# Altium schematic sheet Sheet1.SchDoc
size A4; SheetNumber: 1; SheetTotal: 1
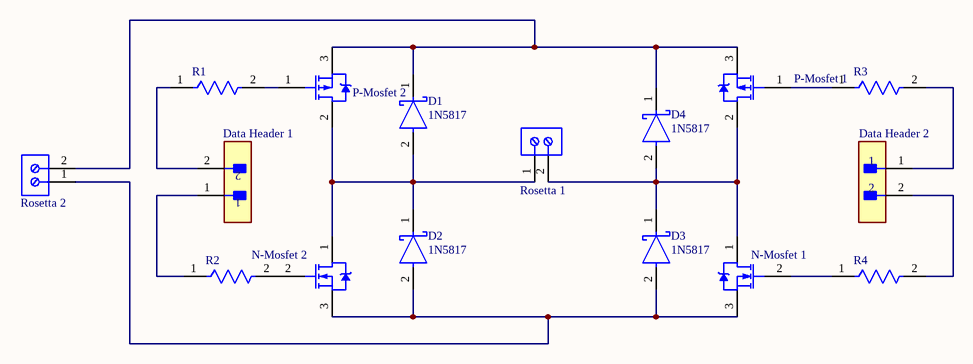
[diagram p0: Sheet1.SchDoc]

## Parts
D1  1N5817  [FP-DO-41-MFG]
D2  1N5817  [FP-DO-41-MFG]
D3  1N5817  [FP-DO-41-MFG]
D4  1N5817  [FP-DO-41-MFG]
Data_Header_1  M20-9990245  [FP-M20-9990245-MFG]  (value not drawn)
Data_Header_2  M20-9990245  [FP-M20-9990245-MFG]  (value not drawn)
N-Mosfet_1  BS170  [ONSC-TO-92-3-29-11]  (value not drawn)
N-Mosfet_2  BS170  [ONSC-TO-92-3-29-11]  (value not drawn)
P-Mosfet_1  NTP2955  [ONSC-TO-220-3-221A-09_AA]  (value not drawn)
P-Mosfet_2  NTP2955  [ONSC-TO-220-3-221A-09_AA]  (value not drawn)
R1  H45K0BAA  [FP-H45K0BAA-MFG]  (value not drawn)
R2  H45K0BAA  [FP-H45K0BAA-MFG]  (value not drawn)
R3  H45K0BAA  [FP-H45K0BAA-MFG]  (value not drawn)
R4  H45K0BAA  [FP-H45K0BAA-MFG]  (value not drawn)
Rosetta_1  691214110002  [691214110002]  (value not drawn)
Rosetta_2  691214110002  [691214110002]  (value not drawn)

## Nets
NetD1_1: D1.1(C) D4.1(C) P-Mosfet_1.3(S) P-Mosfet_2.3(S) Rosetta_2.2
NetD1_2: D1.2(A) D2.1(C) N-Mosfet_2.1(D) P-Mosfet_2.2(D) Rosetta_1.1
NetD2_2: D2.2(A) D3.2(A) N-Mosfet_1.3(S) N-Mosfet_2.3(S) Rosetta_2.1
NetD3_1: D3.1(C) D4.2(A) N-Mosfet_1.1(D) P-Mosfet_1.2(D) Rosetta_1.2
NetData_Header_1_1: Data_Header_1.1 R2.1
NetData_Header_1_2: Data_Header_1.2 R1.1
NetData_Header_2_1: Data_Header_2.1 R3.2
NetData_Header_2_2: Data_Header_2.2 R4.2
NetN-Mosfet_1_2: N-Mosfet_1.2(G) R4.1
NetN-Mosfet_2_2: N-Mosfet_2.2(G) R2.2
NetP-Mosfet_1_1: P-Mosfet_1.1(G) R3.1
NetP-Mosfet_2_1: P-Mosfet_2.1(G) R1.2

## Library data of the parts
D1-D4 = CMP-12187-000037-1: DIODE SCHOTTKY 20V 1A DO41; Max Forward Surge Current (Ifsm): 25A; Forward Voltage: 450mV; Max Reverse Leakage Current: 500uA; Element Configuration: Single; Polarity: Standard; Capacitance: 110pF; Length: 5.2mm; Min Operating Temperature: -65°C; Series: -; Packaging: Cut Tape; Output Current: 1A; RoHS Compliant: Yes; Max Surge Current: 25A; Voltage Rating (DC): 20V; Number of Pins: 2; Width: 2.7mm; Max Reverse Voltage (DC): 20V; Height: 2.7mm; Weight: 0.01lb; Max Operating Temperature: 150°C; Current Rating: 1A; Lead Free: Lead Free; Case/Package: DO-41; Radiation Hardening: No; Package Quantity: 2000; Forward Current: 1A; Max Repetitive Reverse Voltage (Vrrm): 20V; Peak Non-Repetitive Surge Current: 25A; REACH SVHC: No SVHC; Average Rectified Current: 1A; Max Reverse Current: 500uA; Mount: Through Hole
Data_Header_1 Data_Header_2 = CMP-15831-000105-1: CONN HEADER VERT 2POS 2.54MM; Working Voltage: 750V; Gender: Male; Number of Poles: 2; Current Rating: 3A; Mated Stacking Heights: 16.54mm; Contact Resistance: 25mR; Connector Type: Male Pin; Insulation Resistance: 10GR; Mating Cycles: 300; Voltage: 50V; Flammability Rating: UL94 V-0; Pitch: 2.54mm; Series: M20; Number of Contacts: 2; Height: 0.12inch; Min Operating Temperature: -40°C; Contact Finish - Mating: GOLD; Number of Positions: 2; Number of Rows: 1; Packaging: Bulk; Package Quantity: 1000; Voltage Rating (AC): 750V; Current: 3A; Mount: Through Hole; Case/Package: SIL; Orientation: Straight; Contact Shape: Square; Weight: 0.25lb; Radiation Hardening: No; Fastening Type: Pull; Length: 5.08mm; Depth: 2.54mm; Contact Mating Length: 0.24inch; Housing Material: Nylon; Reach SVHC Compliant: Yes; Insulation Material: Nylon; Color: Black; Width: 0.25inch; Insulation Color: Black; Contact Material: Brass; Contact Type: Male Pin; Termination: Solder; Max Operating Temperature: 105°C; Contact Plating: Gold; Housing Color: Black; Max Current Rating: 3A; Lead Pitch: 2.54mm
N-Mosfet_1 N-Mosfet_2 = CMP-1058-00929-1: Small Signal MOSFET, 500 mA, 60 V, N-Channel, 3-Pin TO-92, Bulk Box; Manufacturer: On Semiconductor; VGS Max (V): 20; Configuration: Single; PD Max (W): 0.35; VGS(th) Max (V): 3; ID Max (A): 0.5; V(BR)DSS Min (V): 60; Channel Polarity: N Channel; PackageDescription: 3-Pin Transistor Outline, Body 4.825 x 3.685 mm, Pitch 1.27 mm; Package Type: TO-92; ComponentLink1Description: Manufacturer URL; ComponentLink1URL: http://www.onsemi.com/; DatasheetVersion: Rev. 6; ComponentLink3Description: Package Specification; PartNumber: BS170; ComponentLink2URL: http://www.onsemi.com/pub_link/Collateral/BS170-D.PDF; PackageVersion: Rev. AM; Mounting Technology: Through Hole; PackageReference: TO-92-3-29-11_AM_SL; ComponentLink2Description: Datasheet; ComponentLink3URL: http://www.onsemi.cn/pub_link/Collateral/2N6426-D.PDF; Packing: Bulk Box
P-Mosfet_1 P-Mosfet_2 = CMP-1058-00865-1: Power MOSFET, -60 V, -12 A, Single P-Channel, 3-Pin TO-220, Tube; Manufacturer: On Semiconductor; V(BR)DSS Min (V): 60; Channel Polarity: P Channel; VGS Max (V): 20; Ciss Typ (pF): 507; Crss Typ (pF): 48; VGS(th) Max (V): 4; Qrr Typ (nC): 126; Coss Typ (pF): 150; ID Max (A): 12; PackageDescription: 3-Pin Flange Mount, Vertical Straight Lead, Body 9.97 x 4.445 mm, Pitch 2.54 mm; DatasheetVersion: Rev. 2; Mounting Technology: Through Hole; ComponentLink1URL: http://www.onsemi.com/; PackageVersion: Rev. AA; PackageReference: TO-220-3-221A-09_AA; ComponentLink3URL: http://www.onsemi.com/pub_link/Collateral/MAC16C-D.PDF; ComponentLink2Description: Datasheet; ComponentLink1Description: Manufacturer URL; Configuration: Single; ComponentLink2URL: http://www.onsemi.cn/pub_link/Collateral/NTP2955-D.PDF; ComponentLink3Description: Package Specification; Packing: Tube; Package Type: TO-220-3; PartNumber: NTP2955
R1-R4 = CMP-03212-000004-1: RES 5.00K OHM 1/2W 0.1% AXIAL; Number of Resistors: 1; Power Rating: 500mW; Resistance: 5kR; Temperature Coefficient: 5ppm/°C; Voltage Rating: 350V; Lead Diameter: 0.6mm; Resistor Type: Thin Film; Mount: Axial; Contact Plating: Tin; Weight: 0.01411oz; Packaging: Bulk; Min Operating Temperature: -55°C; Package Quantity: 250; Case/Package: Axial; Number of Terminations: 2; Termination: Axial; Radiation Hardening: No; Max Operating Temperature: 155°C; RoHS Compliant: Yes; Series: Holco, Holsworthy; ELV: Compliant; Tolerance: 0.1%; Diameter: 3.7mm; Length: 10mm; Max Power Dissipation: 500mW
Rosetta_1 Rosetta_2 = CMP-1502-02464-2: NexarPartId: 18818288; Plating: Brass, Steel; Current: 10A; Pitch: 3.5052mm; Number of Levels: 1; Number of Contacts: 2; Wire Gauge (Min): 16AWG; Voltage: 300V; Wire Gauge (Max): 24AWG; Stripping Length: -6mm; Number of Pins: 2; Number of Rows: 1; REACH SVHC: Unknown; RoHS: Compliant; Housing Material: Nylon; Termination: Screw; Mount: Through Hole; Contact Plating: Brass, Tin; Number of Positions Per Level: 2; Color: Blue, Green; Width: 7.9mm; Voltage Rating: 300V; Length: 7.4mm; Current Rating: 10A; Wire/Cable Gauge: 24AWG; Packaging: Box; Max Operating Temperature: 105°C; Lead Pitch: 3.5mm; Height: 8.7mm; Contact Material: Brass; Min Operating Temperature: -40°C